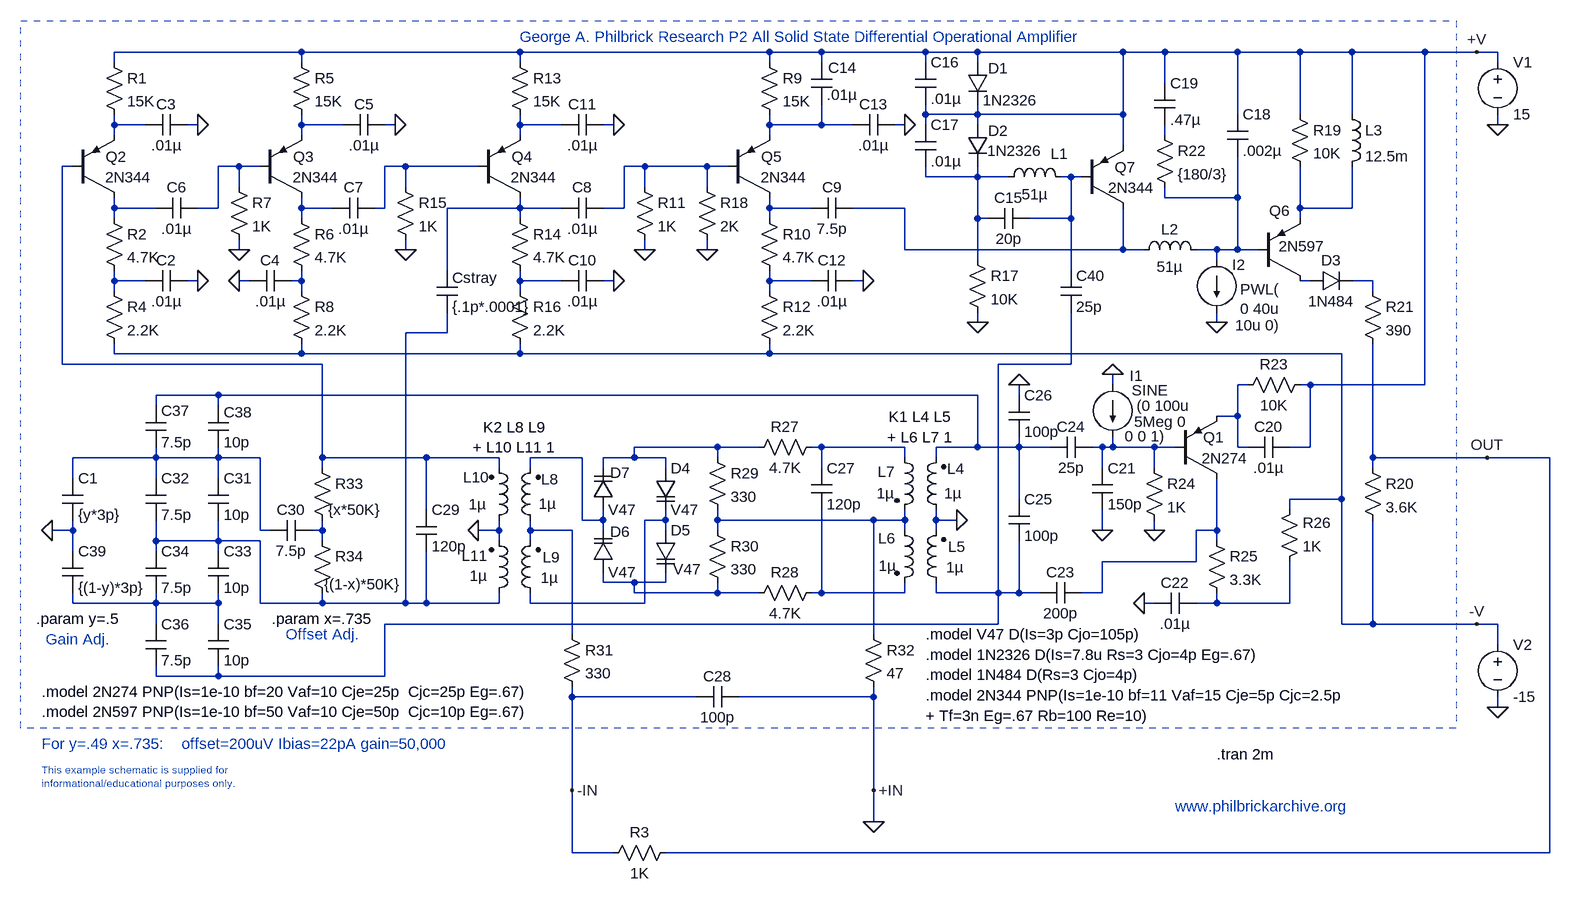
[diagram p0: schematic Unity.asc]
Unity.asc, the LTspice schematic file:
Version 4
SHEET 1 2948 1524
WIRE 464 16 176 16
WIRE 800 16 464 16
WIRE 1184 16 800 16
WIRE 1264 16 1184 16
WIRE 1424 16 1264 16
WIRE 1504 16 1424 16
WIRE 1728 16 1504 16
WIRE 1792 16 1728 16
WIRE 1904 16 1792 16
WIRE 2000 16 1904 16
WIRE 2080 16 2000 16
WIRE 2192 16 2080 16
WIRE 2272 16 2192 16
WIRE 2304 16 2272 16
WIRE 176 32 176 16
WIRE 464 32 464 16
WIRE 800 32 800 16
WIRE 1184 32 1184 16
WIRE 1264 32 1264 16
WIRE 1424 32 1424 16
WIRE 1504 32 1504 16
WIRE 2304 32 2304 16
WIRE 1792 64 1792 16
WIRE 1424 112 1424 96
WIRE 1504 112 1504 96
WIRE 1504 112 1424 112
WIRE 1728 112 1728 16
WIRE 1728 112 1504 112
WIRE 1904 112 1904 16
WIRE 2000 112 2000 16
WIRE 2080 112 2080 16
WIRE 176 128 176 112
WIRE 224 128 176 128
WIRE 304 128 288 128
WIRE 464 128 464 112
WIRE 528 128 464 128
WIRE 608 128 592 128
WIRE 800 128 800 112
WIRE 864 128 800 128
WIRE 944 128 928 128
WIRE 1184 128 1184 112
WIRE 1264 128 1264 96
WIRE 1264 128 1184 128
WIRE 1312 128 1264 128
WIRE 1392 128 1376 128
WIRE 1424 128 1424 112
WIRE 1504 128 1504 112
WIRE 2304 128 2304 112
WIRE 176 144 176 128
WIRE 464 144 464 128
WIRE 800 144 800 128
WIRE 1184 144 1184 128
WIRE 1792 144 1792 128
WIRE 1728 160 1728 112
WIRE 112 192 96 192
WIRE 368 192 336 192
WIRE 400 192 368 192
WIRE 624 192 592 192
WIRE 736 192 624 192
WIRE 992 192 960 192
WIRE 1088 192 992 192
WIRE 1120 192 1088 192
WIRE 1424 208 1424 192
WIRE 1504 208 1504 192
WIRE 1504 208 1424 208
WIRE 1552 208 1504 208
WIRE 1648 208 1632 208
WIRE 1664 208 1648 208
WIRE 368 224 368 192
WIRE 624 224 624 192
WIRE 992 224 992 192
WIRE 1088 224 1088 192
WIRE 1792 240 1792 224
WIRE 1904 240 1904 176
WIRE 1904 240 1792 240
WIRE 176 256 176 240
WIRE 240 256 176 256
WIRE 336 256 336 192
WIRE 336 256 304 256
WIRE 464 256 464 240
WIRE 512 256 464 256
WIRE 592 256 592 192
WIRE 592 256 576 256
WIRE 800 256 800 240
WIRE 800 256 688 256
WIRE 864 256 800 256
WIRE 960 256 960 192
WIRE 960 256 928 256
WIRE 1184 256 1184 240
WIRE 1248 256 1184 256
WIRE 1392 256 1312 256
WIRE 2000 256 2000 192
WIRE 2080 256 2080 192
WIRE 2080 256 2000 256
WIRE 176 272 176 256
WIRE 464 272 464 256
WIRE 800 272 800 256
WIRE 1184 272 1184 256
WIRE 1504 272 1504 208
WIRE 1520 272 1504 272
WIRE 1648 272 1648 208
WIRE 1648 272 1584 272
WIRE 2000 272 2000 256
WIRE 368 320 368 304
WIRE 624 320 624 304
WIRE 992 320 992 304
WIRE 1088 320 1088 304
WIRE 1392 320 1392 256
WIRE 1728 320 1728 256
WIRE 1728 320 1392 320
WIRE 1760 320 1728 320
WIRE 1872 320 1840 320
WIRE 1904 320 1904 240
WIRE 1904 320 1872 320
WIRE 1936 320 1904 320
WIRE 1504 336 1504 272
WIRE 1872 336 1872 320
WIRE 688 352 688 256
WIRE 1648 352 1648 272
WIRE 176 368 176 352
WIRE 224 368 176 368
WIRE 304 368 288 368
WIRE 384 368 368 368
WIRE 464 368 464 352
WIRE 464 368 448 368
WIRE 800 368 800 352
WIRE 864 368 800 368
WIRE 944 368 928 368
WIRE 1184 368 1184 352
WIRE 1248 368 1184 368
WIRE 1328 368 1312 368
WIRE 2016 368 2000 368
WIRE 2112 368 2080 368
WIRE 176 384 176 368
WIRE 464 384 464 368
WIRE 800 384 800 368
WIRE 1184 384 1184 368
WIRE 2112 384 2112 368
WIRE 1504 432 1504 416
WIRE 1872 432 1872 416
WIRE 688 448 688 416
WIRE 688 448 624 448
WIRE 176 480 176 464
WIRE 464 480 464 464
WIRE 464 480 176 480
WIRE 800 480 800 464
WIRE 800 480 464 480
WIRE 1184 480 1184 464
WIRE 1184 480 800 480
WIRE 2064 480 1184 480
WIRE 96 496 96 192
WIRE 496 496 96 496
WIRE 1648 496 1648 416
WIRE 1648 496 1536 496
WIRE 1712 528 1712 512
WIRE 1920 528 1904 528
WIRE 2016 528 2000 528
WIRE 2192 528 2192 16
WIRE 2192 528 2016 528
WIRE 336 544 240 544
WIRE 1504 544 336 544
WIRE 1568 544 1568 528
WIRE 240 560 240 544
WIRE 336 560 336 544
WIRE 1904 576 1904 528
WIRE 1904 576 1872 576
WIRE 1104 624 976 624
WIRE 1168 624 1104 624
WIRE 1264 624 1248 624
WIRE 1392 624 1264 624
WIRE 1504 624 1504 544
WIRE 1504 624 1440 624
WIRE 1568 624 1568 608
WIRE 1568 624 1504 624
WIRE 1616 624 1568 624
WIRE 1696 624 1680 624
WIRE 1712 624 1712 608
WIRE 1712 624 1696 624
WIRE 1776 624 1712 624
WIRE 1808 624 1776 624
WIRE 1904 624 1904 576
WIRE 1920 624 1904 624
WIRE 2016 624 2016 528
WIRE 2016 624 1984 624
WIRE 240 640 240 624
WIRE 240 640 112 640
WIRE 336 640 336 624
WIRE 336 640 240 640
WIRE 400 640 336 640
WIRE 496 640 496 496
WIRE 656 640 496 640
WIRE 768 640 656 640
WIRE 896 640 816 640
WIRE 976 640 976 624
WIRE 976 640 928 640
WIRE 1024 640 976 640
WIRE 1104 640 1104 624
WIRE 1392 640 1392 624
WIRE 1440 640 1440 624
WIRE 2112 640 2112 464
WIRE 2288 640 2112 640
WIRE 2384 640 2288 640
WIRE 496 656 496 640
WIRE 768 656 768 640
WIRE 816 656 816 640
WIRE 928 656 928 640
WIRE 1024 656 1024 640
WIRE 1264 656 1264 624
WIRE 1696 656 1696 624
WIRE 1776 656 1776 624
WIRE 2112 656 2112 640
WIRE 112 672 112 640
WIRE 240 672 240 640
WIRE 336 672 336 640
WIRE 1568 704 1568 624
WIRE 2064 704 2064 480
WIRE 2064 704 1984 704
WIRE 656 720 656 640
WIRE 1984 720 1984 704
WIRE 896 736 896 640
WIRE 928 736 928 720
WIRE 928 736 896 736
WIRE 1024 736 1024 720
WIRE 1024 736 992 736
WIRE 1104 736 1104 720
WIRE 1344 736 1104 736
WIRE 1392 736 1392 720
WIRE 1392 736 1344 736
WIRE 1440 736 1440 720
WIRE 1472 736 1440 736
WIRE 112 752 112 736
WIRE 112 752 80 752
WIRE 400 752 400 640
WIRE 416 752 400 752
WIRE 496 752 496 736
WIRE 496 752 480 752
WIRE 768 752 768 736
WIRE 768 752 736 752
WIRE 816 752 816 736
WIRE 880 752 816 752
WIRE 928 752 928 736
WIRE 1024 752 1024 736
WIRE 1104 752 1104 736
WIRE 1392 752 1392 736
WIRE 1440 752 1440 736
WIRE 1696 752 1696 720
WIRE 1776 752 1776 736
WIRE 1872 752 1872 672
WIRE 1872 752 1840 752
WIRE 240 768 240 736
WIRE 336 768 336 736
WIRE 336 768 240 768
WIRE 400 768 336 768
WIRE 496 768 496 752
WIRE 768 768 768 752
WIRE 816 768 816 752
WIRE 1872 768 1872 752
WIRE 112 784 112 752
WIRE 240 784 240 768
WIRE 336 784 336 768
WIRE 1840 800 1840 752
WIRE 1840 800 1696 800
WIRE 928 832 928 816
WIRE 976 832 928 832
WIRE 1024 832 1024 816
WIRE 1024 832 976 832
WIRE 976 848 976 832
WIRE 1104 848 1104 832
WIRE 1104 848 976 848
WIRE 1168 848 1104 848
WIRE 1264 848 1264 720
WIRE 1264 848 1248 848
WIRE 1392 848 1392 832
WIRE 1392 848 1264 848
WIRE 1440 848 1440 832
WIRE 1536 848 1536 496
WIRE 1536 848 1440 848
WIRE 1568 848 1568 768
WIRE 1568 848 1536 848
WIRE 1600 848 1568 848
WIRE 1696 848 1696 800
WIRE 1696 848 1664 848
WIRE 112 864 112 848
WIRE 240 864 240 848
WIRE 240 864 112 864
WIRE 336 864 336 848
WIRE 336 864 240 864
WIRE 400 864 400 768
WIRE 496 864 496 848
WIRE 496 864 400 864
WIRE 624 864 624 448
WIRE 624 864 496 864
WIRE 656 864 656 784
WIRE 656 864 624 864
WIRE 768 864 768 848
WIRE 768 864 656 864
WIRE 816 864 816 848
WIRE 992 864 992 736
WIRE 992 864 816 864
WIRE 1776 864 1760 864
WIRE 1872 864 1872 848
WIRE 1872 864 1840 864
WIRE 1984 864 1984 800
WIRE 1984 864 1872 864
WIRE 240 896 240 864
WIRE 336 896 336 864
WIRE 1536 896 1536 848
WIRE 1536 896 592 896
WIRE 2064 896 2064 704
WIRE 2112 896 2112 736
WIRE 2112 896 2064 896
WIRE 2272 896 2112 896
WIRE 2304 896 2272 896
WIRE 880 912 880 752
WIRE 1344 912 1344 736
WIRE 2304 928 2304 896
WIRE 240 976 240 960
WIRE 336 976 336 960
WIRE 336 976 240 976
WIRE 592 976 592 896
WIRE 592 976 336 976
WIRE 880 1008 880 992
WIRE 1072 1008 880 1008
WIRE 1344 1008 1344 992
WIRE 1344 1008 1136 1008
WIRE 2304 1024 2304 1008
WIRE 880 1152 880 1008
WIRE 1344 1152 1344 1008
WIRE 1344 1200 1344 1152
WIRE 880 1248 880 1152
WIRE 944 1248 880 1248
WIRE 2384 1248 2384 640
WIRE 2384 1248 1024 1248
FLAG 2272 16 +V
FLAG 2304 128 0
FLAG 2304 1024 0
FLAG 304 368 0
FLAG 304 128 0
FLAG 368 320 0
FLAG 368 368 0
FLAG 608 128 0
FLAG 624 320 0
FLAG 944 368 0
FLAG 944 128 0
FLAG 992 320 0
FLAG 1328 368 0
FLAG 1392 128 0
FLAG 1088 320 0
FLAG 1504 432 0
FLAG 1776 752 0
FLAG 1760 864 0
FLAG 1696 752 0
FLAG 1568 528 0
FLAG 1472 736 0
FLAG 1344 1200 0
FLAG 736 752 0
FLAG 80 752 0
FLAG 1712 512 0
FLAG 1872 432 0
FLAG 2272 896 -V
FLAG 2288 640 OUT
FLAG 880 1152 -IN
FLAG 1344 1152 +IN
SYMBOL pnp 112 240 M180
WINDOW 0 51 63 Left 2
WINDOW 3 50 31 Left 2
SYMATTR InstName Q2
SYMATTR Value 2N344
SYMBOL res 160 16 R0
SYMATTR InstName R1
SYMATTR Value 15K
SYMBOL res 160 256 R0
SYMATTR InstName R2
SYMATTR Value 4.7K
SYMBOL res 160 368 R0
SYMATTR InstName R4
SYMATTR Value 2.2K
SYMBOL voltage 2304 16 R0
SYMATTR InstName V1
SYMATTR Value 15
SYMBOL voltage 2304 912 R0
SYMATTR InstName V2
SYMATTR Value -15
SYMBOL cap 288 384 M270
WINDOW 0 32 32 VTop 2
WINDOW 3 0 32 VBottom 2
SYMATTR InstName C2
SYMATTR Value .01µ
SYMBOL cap 288 144 M270
WINDOW 0 32 32 VTop 2
WINDOW 3 0 32 VBottom 2
SYMATTR InstName C3
SYMATTR Value .01µ
SYMBOL res 448 16 R0
SYMATTR InstName R5
SYMATTR Value 15K
SYMBOL res 448 256 R0
SYMATTR InstName R6
SYMATTR Value 4.7K
SYMBOL res 352 208 R0
SYMATTR InstName R7
SYMATTR Value 1K
SYMBOL res 448 368 R0
SYMATTR InstName R8
SYMATTR Value 2.2K
SYMBOL cap 384 384 R270
WINDOW 0 32 32 VTop 2
WINDOW 3 0 32 VBottom 2
SYMATTR InstName C4
SYMATTR Value .01µ
SYMBOL cap 592 144 M270
WINDOW 0 32 32 VTop 2
WINDOW 3 0 32 VBottom 2
SYMATTR InstName C5
SYMATTR Value .01µ
SYMBOL res 784 16 R0
SYMATTR InstName R13
SYMATTR Value 15K
SYMBOL res 784 256 R0
SYMATTR InstName R14
SYMATTR Value 4.7K
SYMBOL res 608 208 R0
SYMATTR InstName R15
SYMATTR Value 1K
SYMBOL res 784 368 R0
SYMATTR InstName R16
SYMATTR Value 2.2K
SYMBOL cap 928 384 M270
WINDOW 0 32 32 VTop 2
WINDOW 3 0 32 VBottom 2
SYMATTR InstName C10
SYMATTR Value .01µ
SYMBOL cap 928 144 M270
WINDOW 0 32 32 VTop 2
WINDOW 3 0 32 VBottom 2
SYMATTR InstName C11
SYMATTR Value .01µ
SYMBOL res 1168 16 R0
SYMATTR InstName R9
SYMATTR Value 15K
SYMBOL res 1168 256 R0
SYMATTR InstName R10
SYMATTR Value 4.7K
SYMBOL res 976 208 R0
SYMATTR InstName R11
SYMATTR Value 1K
SYMBOL res 1168 368 R0
SYMATTR InstName R12
SYMATTR Value 2.2K
SYMBOL cap 1312 384 M270
WINDOW 0 32 32 VTop 2
WINDOW 3 0 32 VBottom 2
SYMATTR InstName C12
SYMATTR Value .01µ
SYMBOL cap 1376 144 M270
WINDOW 0 32 32 VTop 2
WINDOW 3 0 32 VBottom 2
SYMATTR InstName C13
SYMATTR Value .01µ
SYMBOL cap 304 272 M270
WINDOW 0 32 32 VTop 2
WINDOW 3 0 32 VBottom 2
SYMATTR InstName C6
SYMATTR Value .01µ
SYMBOL cap 576 272 M270
WINDOW 0 32 32 VTop 2
WINDOW 3 0 32 VBottom 2
SYMATTR InstName C7
SYMATTR Value .01µ
SYMBOL cap 928 272 M270
WINDOW 0 32 32 VTop 2
WINDOW 3 0 32 VBottom 2
SYMATTR InstName C8
SYMATTR Value .01µ
SYMBOL cap 1312 272 M270
WINDOW 0 32 32 VTop 2
WINDOW 3 0 32 VBottom 2
SYMATTR InstName C9
SYMATTR Value 7.5p
SYMBOL pnp 400 240 M180
WINDOW 0 51 63 Left 2
WINDOW 3 50 31 Left 2
SYMATTR InstName Q3
SYMATTR Value 2N344
SYMBOL pnp 736 240 M180
WINDOW 0 51 63 Left 2
WINDOW 3 50 31 Left 2
SYMATTR InstName Q4
SYMATTR Value 2N344
SYMBOL pnp 1120 240 M180
WINDOW 0 51 63 Left 2
WINDOW 3 50 31 Left 2
SYMATTR InstName Q5
SYMATTR Value 2N344
SYMBOL res 1072 208 R0
SYMATTR InstName R18
SYMATTR Value 2K
SYMBOL cap 1248 96 M180
WINDOW 0 26 56 Left 2
WINDOW 3 24 14 Left 2
SYMATTR InstName C14
SYMATTR Value .01µ
SYMBOL pnp 1664 256 M180
WINDOW 0 51 63 Left 2
WINDOW 3 41 31 Left 2
SYMATTR InstName Q7
SYMATTR Value 2N344
SYMBOL diode 1488 32 R0
WINDOW 0 32 9 Left 2
WINDOW 3 24 58 Left 2
SYMATTR InstName D1
SYMATTR Value 1N2326
SYMBOL cap 1408 96 M180
WINDOW 0 24 64 Left 2
WINDOW 3 24 8 Left 2
SYMATTR InstName C16
SYMATTR Value .01µ
SYMBOL cap 1408 192 M180
WINDOW 0 24 64 Left 2
WINDOW 3 24 8 Left 2
SYMATTR InstName C17
SYMATTR Value .01µ
SYMBOL ind 1536 224 R270
WINDOW 0 36 94 VTop 2
WINDOW 3 5 56 VBottom 2
SYMATTR InstName L1
SYMATTR Value 51µ
SYMBOL ind 1744 336 R270
WINDOW 0 32 56 VTop 2
WINDOW 3 5 56 VBottom 2
SYMATTR InstName L2
SYMATTR Value 51µ
SYMBOL cap 1584 256 R90
WINDOW 0 0 32 VBottom 2
WINDOW 3 32 32 VTop 2
SYMATTR InstName C15
SYMATTR Value 20p
SYMBOL res 1488 320 R0
SYMATTR InstName R17
SYMATTR Value 10K
SYMBOL diode 1488 128 R0
WINDOW 0 32 9 Left 2
WINDOW 3 31 40 Left 2
SYMATTR InstName D2
SYMATTR Value 1N2326
SYMBOL pnp 1936 368 M180
WINDOW 0 49 108 Right 2
WINDOW 3 31 53 Left 2
SYMATTR InstName Q6
SYMATTR Value 2N597
SYMBOL res 1984 96 R0
SYMATTR InstName R19
SYMATTR Value 10K
SYMBOL ind 2064 96 R0
SYMATTR InstName L3
SYMATTR Value 12.5m
SYMBOL diode 2016 384 R270
WINDOW 3 0 32 VBottom 2
WINDOW 0 32 32 VTop 2
SYMATTR Value 1N484
SYMATTR InstName D3
SYMBOL res 2096 640 R0
SYMATTR InstName R20
SYMATTR Value 3.6K
SYMBOL res 2096 368 R0
SYMATTR InstName R21
SYMATTR Value 390
SYMBOL cap 1888 176 M180
WINDOW 0 24 64 Left 2
WINDOW 3 24 8 Left 2
SYMATTR InstName C18
SYMATTR Value .002µ
SYMBOL cap 1776 128 M180
WINDOW 0 24 64 Left 2
WINDOW 3 24 8 Left 2
SYMATTR InstName C19
SYMATTR Value .47µ
SYMBOL res 1776 128 R0
SYMATTR InstName R22
SYMATTR Value {180/3}
SYMBOL pnp 1808 672 M180
WINDOW 0 43 63 Left 2
WINDOW 3 41 31 Left 2
SYMATTR InstName Q1
SYMATTR Value 2N274
SYMBOL res 2016 512 R90
WINDOW 0 0 56 VBottom 2
WINDOW 3 32 56 VTop 2
SYMATTR InstName R23
SYMATTR Value 10K
SYMBOL cap 1920 608 M90
WINDOW 0 0 32 VBottom 2
WINDOW 3 32 32 VTop 2
SYMATTR InstName C20
SYMATTR Value .01µ
SYMBOL res 1760 640 R0
SYMATTR InstName R24
SYMATTR Value 1K
SYMBOL cap 1680 720 M180
WINDOW 0 24 64 Left 2
WINDOW 3 24 8 Left 2
SYMATTR InstName C21
SYMATTR Value 150p
SYMBOL res 1856 752 R0
SYMATTR InstName R25
SYMATTR Value 3.3K
SYMBOL res 1968 816 M180
WINDOW 0 36 76 Left 2
WINDOW 3 36 40 Left 2
SYMATTR InstName R26
SYMATTR Value 1K
SYMBOL cap 1776 880 R270
WINDOW 0 32 32 VTop 2
WINDOW 3 0 32 VBottom 2
SYMATTR InstName C22
SYMATTR Value .01µ
SYMBOL cap 1664 864 M270
WINDOW 0 32 32 VTop 2
WINDOW 3 0 32 VBottom 2
SYMATTR InstName C23
SYMATTR Value 200p
SYMBOL cap 1680 640 M270
WINDOW 0 32 32 VTop 2
WINDOW 3 0 32 VBottom 2
SYMATTR InstName C24
SYMATTR Value 25p
SYMBOL cap 1552 768 M180
WINDOW 0 24 64 Left 2
WINDOW 3 24 8 Left 2
SYMATTR InstName C25
SYMATTR Value 100p
SYMBOL cap 1552 608 M180
WINDOW 0 24 64 Left 2
WINDOW 3 24 8 Left 2
SYMATTR InstName C26
SYMATTR Value 100p
SYMBOL ind2 1456 736 R180
WINDOW 0 -1 79 Right 2
WINDOW 3 3 41 Right 2
SYMATTR InstName L4
SYMATTR Value 1µ
SYMATTR Type ind
SYMBOL ind2 1456 848 R180
WINDOW 0 -3 71 Right 2
WINDOW 3 0 39 Right 2
SYMATTR InstName L5
SYMATTR Value 1µ
SYMATTR Type ind
SYMBOL ind2 1376 736 R0
WINDOW 0 2 28 Right 2
WINDOW 3 3 70 Right 2
SYMATTR InstName L6
SYMATTR Value 1µ
SYMATTR Type ind
SYMBOL ind2 1376 624 R0
WINDOW 0 1 38 Right 2
WINDOW 3 0 71 Right 2
SYMATTR InstName L7
SYMATTR Value 1µ
SYMATTR Type ind
SYMBOL cap 1248 720 M180
WINDOW 0 24 64 Left 2
WINDOW 3 24 8 Left 2
SYMATTR InstName C27
SYMATTR Value 120p
SYMBOL res 1264 608 R90
WINDOW 0 0 56 VBottom 2
WINDOW 3 32 56 VTop 2
SYMATTR InstName R27
SYMATTR Value 4.7K
SYMBOL res 1264 832 R90
WINDOW 0 0 56 VBottom 2
WINDOW 3 32 56 VTop 2
SYMATTR InstName R28
SYMATTR Value 4.7K
SYMBOL res 1088 624 R0
SYMATTR InstName R29
SYMATTR Value 330
SYMBOL res 1088 736 R0
SYMATTR InstName R30
SYMATTR Value 330
SYMBOL varactor 1008 656 R0
SYMATTR Value V47
SYMATTR InstName D4
SYMBOL varactor 1008 752 R0
WINDOW 3 28 60 Left 2
SYMATTR Value V47
SYMATTR InstName D5
SYMBOL varactor 912 816 M180
WINDOW 0 27 62 Left 2
WINDOW 3 24 0 Left 2
SYMATTR InstName D6
SYMATTR Value V47
SYMBOL varactor 912 720 M180
WINDOW 0 27 57 Left 2
WINDOW 3 24 0 Left 2
SYMATTR InstName D7
SYMATTR Value V47
SYMBOL ind2 832 752 R180
WINDOW 0 -1 79 Right 2
WINDOW 3 3 41 Right 2
SYMATTR InstName L8
SYMATTR Value 1µ
SYMATTR Type ind
SYMBOL ind2 832 864 R180
WINDOW 0 -3 71 Right 2
WINDOW 3 0 39 Right 2
SYMATTR InstName L9
SYMATTR Value 1µ
SYMATTR Type ind
SYMBOL ind2 752 752 M180
WINDOW 0 1 82 Right 2
WINDOW 3 -4 40 Right 2
SYMATTR InstName L10
SYMATTR Value 1µ
SYMATTR Type ind
SYMBOL ind2 752 864 M180
WINDOW 0 -1 73 Right 2
WINDOW 3 -2 42 Right 2
SYMATTR InstName L11
SYMATTR Value 1µ
SYMATTR Type ind
SYMBOL res 864 896 R0
SYMATTR InstName R31
SYMATTR Value 330
SYMBOL res 1328 896 R0
SYMATTR InstName R32
SYMATTR Value 47
SYMBOL cap 1136 1024 M270
WINDOW 0 32 32 VTop 2
WINDOW 3 0 32 VBottom 2
SYMATTR InstName C28
SYMATTR Value 100p
SYMBOL cap 640 784 M180
WINDOW 0 24 64 Left 2
WINDOW 3 24 8 Left 2
SYMATTR InstName C29
SYMATTR Value 120p
SYMBOL res 480 640 R0
WINDOW 3 25 80 Left 2
SYMATTR Value {x*50K}
SYMATTR InstName R33
SYMBOL res 480 752 R0
WINDOW 3 19 83 Left 2
SYMATTR Value {(1-x)*50K}
SYMATTR InstName R34
SYMBOL cap 480 768 M270
WINDOW 0 32 32 VTop 2
WINDOW 3 0 32 VBottom 2
SYMATTR InstName C30
SYMATTR Value 7.5p
SYMBOL cap 320 736 M180
WINDOW 0 24 64 Left 2
WINDOW 3 24 8 Left 2
SYMATTR InstName C31
SYMATTR Value 10p
SYMBOL cap 224 736 M180
WINDOW 0 24 64 Left 2
WINDOW 3 24 8 Left 2
SYMATTR InstName C32
SYMATTR Value 7.5p
SYMBOL cap 320 848 M180
WINDOW 0 24 64 Left 2
WINDOW 3 24 8 Left 2
SYMATTR InstName C33
SYMATTR Value 10p
SYMBOL cap 224 848 M180
WINDOW 0 24 64 Left 2
WINDOW 3 24 8 Left 2
SYMATTR InstName C34
SYMATTR Value 7.5p
SYMBOL cap 320 960 M180
WINDOW 0 24 64 Left 2
WINDOW 3 24 8 Left 2
SYMATTR InstName C35
SYMATTR Value 10p
SYMBOL cap 224 960 M180
WINDOW 0 24 64 Left 2
WINDOW 3 24 8 Left 2
SYMATTR InstName C36
SYMATTR Value 7.5p
SYMBOL cap 224 624 M180
WINDOW 0 24 56 Left 2
WINDOW 3 24 8 Left 2
SYMATTR InstName C37
SYMATTR Value 7.5p
SYMBOL cap 320 624 M180
WINDOW 0 24 54 Left 2
WINDOW 3 24 8 Left 2
SYMATTR InstName C38
SYMATTR Value 10p
SYMBOL cap 96 736 M180
WINDOW 0 24 64 Left 2
WINDOW 3 24 8 Left 2
SYMATTR InstName C1
SYMATTR Value {y*3p}
SYMBOL cap 96 848 M180
WINDOW 0 24 64 Left 2
WINDOW 3 24 8 Left 2
SYMATTR InstName C39
SYMATTR Value {(1-y)*3p}
SYMBOL cap 1632 352 R0
SYMATTR InstName C40
SYMATTR Value 25p
SYMBOL current 1872 336 R0
WINDOW 3 36 45 Left 2
WINDOW 123 36 75 Left 2
WINDOW 39 28 100 Left 2
WINDOW 0 24 7 Left 2
SYMATTR Value PWL(
SYMATTR Value2 0 40u
SYMATTR SpiceLine 10u 0)
SYMATTR InstName I2
SYMBOL res 1040 1232 R90
WINDOW 0 0 56 VBottom 2
WINDOW 3 32 56 VTop 2
SYMATTR InstName R3
SYMATTR Value 1K
SYMBOL cap 672 416 M180
WINDOW 0 24 53 Left 2
WINDOW 3 24 8 Left 2
SYMATTR InstName Cstray
SYMATTR Value {.1p*.0001}
SYMBOL current 1712 528 M0
WINDOW 0 -26 -14 Right 2
WINDOW 3 -29 8 Right 2
WINDOW 123 -37 32 Right 2
WINDOW 39 -33 57 Right 2
WINDOW 40 -18 79 Right 2
SYMATTR InstName I1
SYMATTR Value SINE
SYMATTR Value2 (0 100u
SYMATTR SpiceLine 5Meg 0
SYMATTR SpiceLine2 0 0 1)
TEXT 1424 912 Left 2 !.model V47 D(Is=3p Cjo=105p)\n.model 1N2326 D(Is=7.8u Rs=3 Cjo=4p Eg=.67)\n.model 1N484 D(Rs=3 Cjo=4p)\n.model 2N344 PNP(Is=1e-10 bf=11 Vaf=15 Cje=5p Cjc=2.5p\n+ Tf=3n Eg=.67 Rb=100 Re=10)
TEXT 1872 1096 Left 2 !.tran 2m
TEXT 1416 624 Bottom 2 !K1 L4 L5\n+ L6 L7 1
TEXT 792 640 Bottom 2 !K2 L8 L9\n+ L10 L11 1
TEXT 496 872 Top 2 !.param x=.735
TEXT 120 872 Top 2 !.param y=.5
TEXT 64 1080 Left 2 ;For y=.49 x=.735:    offset=200uV Ibias=22pA gain=50,000
TEXT 1232 8 Bottom 2 ;George A. Philbrick Research P2 All Solid State Differential Operational Amplifier
TEXT 120 904 Top 2 ;Gain Adj.
TEXT 496 896 Top 2 ;Offset Adj.
TEXT 1808 1176 Left 2 ;www.philbrickarchive.org
TEXT 64 1120 Left 1 ;This example schematic is supplied for\ninformational/educational purposes only.
TEXT 64 1000 Left 2 !.model 2N274 PNP(Is=1e-10 bf=20 Vaf=10 Cje=25p  Cjc=25p Eg=.67)\n.model 2N597 PNP(Is=1e-10 bf=50 Vaf=10 Cje=50p  Cjc=10p Eg=.67)
RECTANGLE Normal 2240 1056 32 -32 2

The netlist it stands for:
* Unity.asc
Q2 N013 N006 N001 0 2N344
R1 +V N001 15K
R2 N013 N019 4.7K
R4 N019 -V 2.2K
V1 +V 0 15
V2 -V 0 -15
C2 0 N019 .01µ
C3 0 N001 .01µ
R5 +V N002 15K
R6 N014 N020 4.7K
R7 N007 0 1K
R8 N020 -V 2.2K
C4 0 N020 .01µ
C5 0 N002 .01µ
R13 +V N003 15K
R14 N015 N021 4.7K
R15 N008 0 1K
R16 N021 -V 2.2K
C10 0 N021 .01µ
C11 0 N003 .01µ
R9 +V N004 15K
R10 N016 N022 4.7K
R11 N009 0 1K
R12 N022 -V 2.2K
C12 0 N022 .01µ
C13 0 N004 .01µ
C6 N007 N013 .01µ
C7 N008 N014 .01µ
C8 N009 N015 .01µ
C9 N017 N016 7.5p
Q3 N014 N007 N002 0 2N344
Q4 N015 N008 N003 0 2N344
Q5 N016 N009 N004 0 2N344
R18 N009 0 2K
C14 N004 +V .01µ
Q7 N017 N011 +V 0 2N344
D1 +V +V 1N2326
C16 +V +V .01µ
C17 N010 +V .01µ
L1 N010 N011 51µ
L2 N017 N012 51µ
C15 N011 N010 20p
R17 N010 0 10K
D2 +V N010 1N2326
Q6 N023 N012 N018 0 2N597
R19 +V N018 10K
L3 +V N018 12.5m
D3 N023 N024 1N484
R20 OUT -V 3.6K
R21 N024 OUT 390
C18 N012 +V .002µ
C19 N005 +V .47µ
R22 N005 N012 {180/3}
Q1 N038 N031 N027 0 2N274
R23 +V N027 10K
C20 N027 +V .01µ
R24 N031 0 1K
C21 0 N031 150p
R25 N038 N042 3.3K
R26 N042 -V 1K
C22 0 N042 .01µ
C23 N038 N026 200p
C24 N031 N028 25p
C25 N026 N028 100p
C26 N028 0 100p
L4 0 N028 1µ
L5 N026 0 1µ
L6 N035 N040 1µ
L7 N030 N035 1µ
C27 N040 N030 120p
R27 N030 N029 4.7K
R28 N040 N039 4.7K
R29 N029 N035 330
R30 N035 N039 330
D4 N029 N034 V47
D5 N034 N039 V47
D6 N039 N033 V47
D7 N033 N029 V47
L8 N037 N033 1µ
L9 N034 N037 1µ
L10 0 N006 1µ
L11 N025 0 1µ
R31 N037 -IN 330
R32 N035 0 47
C28 0 -IN 100p
C29 N025 N006 120p
R33 N006 N036 {x*50K}
R34 N036 N025 {(1-x)*50K}
C30 N036 N032 7.5p
C31 N025 N032 10p
C32 N025 N032 7.5p
C33 N041 N025 10p
C34 N041 N025 7.5p
C35 N026 N041 10p
C36 N026 N041 7.5p
C37 N032 N028 7.5p
C38 N032 N028 10p
C1 0 N032 {y*3p}
C39 N041 0 {(1-y)*3p}
C40 N011 N026 25p
I2 N012 0 PWL( 0 40u 10u 0)
R3 OUT -IN 1K
Cstray N025 N015 {.1p*.0001}
I1 0 N031 SINE (0 100u 5Meg 0 0 0 1)
.model D D
.lib standard.dio
.model NPN NPN
.model PNP PNP
.lib standard.bjt
.model V47 D(Is=3p Cjo=105p)
.model 1N2326 D(Is=7.8u Rs=3 Cjo=4p Eg=.67)
.model 1N484 D(Rs=3 Cjo=4p)
.model 2N344 PNP(Is=1e-10 bf=11 Vaf=15 Cje=5p Cjc=2.5p
+ Tf=3n Eg=.67 Rb=100 Re=10)
.tran 2m
K1 L4 L5
+ L6 L7 1
K2 L8 L9
+ L10 L11 1
.param x=.735
.param y=.5
* For y=.49 x=.735:    offset=200uV Ibias=22pA gain=50,000
* George A. Philbrick Research P2 All Solid State Differential Operational Amplifier
* Gain Adj.
* Offset Adj.
* www.philbrickarchive.org
* This example schematic is supplied for
* informational/educational purposes only.
.model 2N274 PNP(Is=1e-10 bf=20 Vaf=10 Cje=25p  Cjc=25p Eg=.67)
.model 2N597 PNP(Is=1e-10 bf=50 Vaf=10 Cje=50p  Cjc=10p Eg=.67)
.backanno
.end